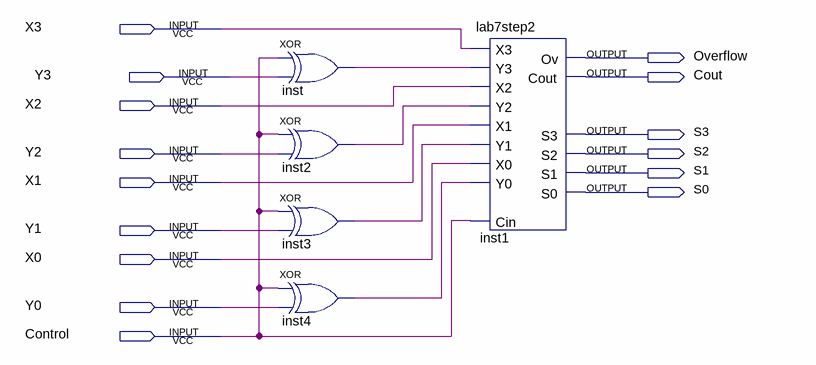
[diagram p0: schematic sheet]
// Quartus schematic lab7step3.bdf as structural Verilog: 5 symbols, 15 pins
module lab7step3 (
  input  X3,
  input  Y3,
  input  X2,
  input  Y2,
  input  X1,
  input  Y1,
  input  X0,
  input  Y0,
  input  Control,
  output Overflow,
  output Cout,
  output S3,
  output S2,
  output S1,
  output S0
);

  wire inst2_out, inst3_out, inst4_out, inst_out;

  xor inst (inst_out, Control, Y3);
  xor inst2 (inst2_out, Control, Y2);
  xor inst3 (inst3_out, Control, Y1);
  xor inst4 (inst4_out, Control, Y0);
  lab7step2 inst1 (
    .Cin(Control), .X0(X0), .Y0(inst4_out), .X1(X1), .Y1(inst3_out), .X2(X2), .Y2(inst2_out), .X3(X3),
    .Y3(inst_out), .S0(S0), .S1(S1), .S2(S2), .Ov(Overflow), .S3(S3), .Cout(Cout));
endmodule
